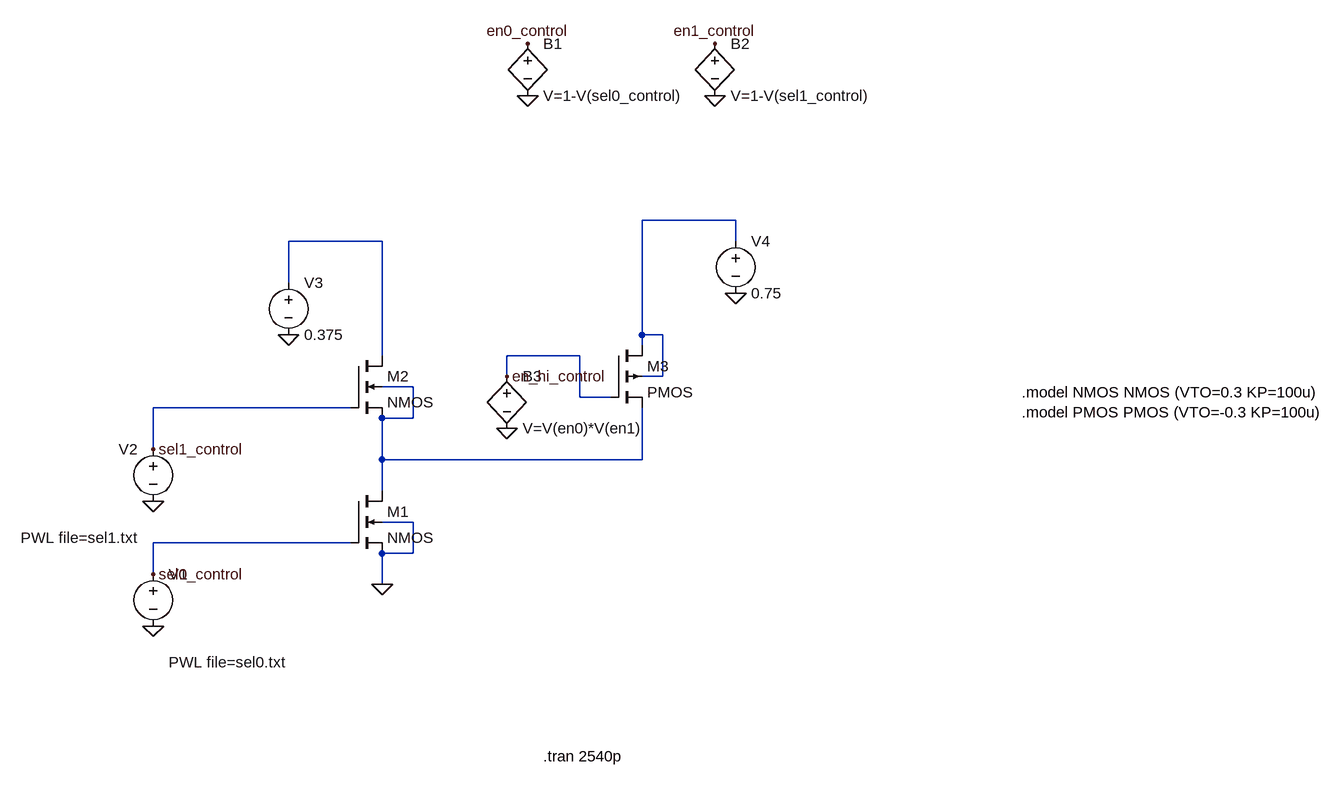
[diagram p0: schematic pulluppulldown_pam3_driver.asc]
pulluppulldown_pam3_driver.asc, the LTspice schematic file:
Version 4
SHEET 1 1388 776
WIRE 464 -64 320 -64
WIRE -80 -32 -224 -32
WIRE 464 -32 464 -64
WIRE -224 32 -224 -32
WIRE 320 112 320 -64
WIRE 352 112 320 112
WIRE 320 128 320 112
WIRE -80 144 -80 -32
WIRE 224 144 112 144
WIRE 112 176 112 144
WIRE 352 176 352 112
WIRE 352 176 320 176
WIRE -32 192 -80 192
WIRE 224 208 224 144
WIRE 272 208 224 208
WIRE -128 224 -432 224
WIRE -32 240 -32 192
WIRE -32 240 -80 240
WIRE -432 288 -432 224
WIRE -80 304 -80 240
WIRE 320 304 320 224
WIRE 320 304 -80 304
WIRE -80 352 -80 304
WIRE -32 400 -80 400
WIRE -128 432 -432 432
WIRE -32 448 -32 400
WIRE -32 448 -80 448
WIRE -432 480 -432 432
WIRE -80 496 -80 448
FLAG -432 480 sel0_control
FLAG -432 368 0
FLAG -432 560 0
FLAG -432 288 sel1_control
FLAG 144 -256 0
FLAG 144 -336 en0_control
FLAG 432 -256 0
FLAG 432 -336 en1_control
FLAG 112 176 en_hi_control
FLAG 112 256 0
FLAG -80 496 0
FLAG -224 112 0
FLAG 464 48 0
SYMBOL voltage -432 464 R0
WINDOW 3 24 152 Left 2
WINDOW 123 0 0 Left 0
WINDOW 39 24 124 Left 2
SYMATTR Value PWL file=sel0.txt
SYMATTR InstName V1
SYMBOL voltage -432 272 M0
WINDOW 3 24 152 Left 2
WINDOW 123 0 0 Left 0
WINDOW 39 24 124 Left 2
SYMATTR Value PWL file=sel1.txt
SYMATTR InstName V2
SYMBOL bv 144 -352 R0
SYMATTR InstName B1
SYMATTR Value V=1-V(sel0_control)
SYMBOL bv 432 -352 R0
SYMATTR InstName B2
SYMATTR Value V=1-V(sel1_control)
SYMBOL bv 112 160 R0
SYMATTR InstName B3
SYMATTR Value V=V(en0)*V(en1)
SYMBOL nmos4 -128 352 R0
SYMATTR InstName M1
SYMATTR Value2 l=45n w=1.0u
SYMBOL nmos4 -128 144 R0
SYMATTR InstName M2
SYMATTR Value2 l=45n w=1.0u
SYMBOL voltage -224 16 R0
WINDOW 123 0 0 Left 0
WINDOW 39 0 0 Left 0
SYMATTR InstName V3
SYMATTR Value 0.375
SYMBOL pmos4 272 128 R0
SYMATTR InstName M3
SYMATTR Value2 l=45n w=1.0u
SYMBOL voltage 464 -48 R0
WINDOW 123 0 0 Left 0
WINDOW 39 0 0 Left 0
SYMATTR InstName V4
SYMATTR Value 0.75
TEXT 168 760 Left 2 !.tran 2540p
TEXT 904 200 Left 2 !.model NMOS NMOS (VTO=0.3 KP=100u)\n.model PMOS PMOS (VTO=-0.3 KP=100u)

The netlist it stands for:
* pulluppulldown_pam3_driver.asc
V1 sel0_control 0 PWL file=sel0.txt
V2 sel1_control 0 PWL file=sel1.txt
B1 en0_control 0 V=1-V(sel0_control)
B2 en1_control 0 V=1-V(sel1_control)
B3 en_hi_control 0 V=V(en0)*V(en1)
M1 N003 sel0_control 0 0 NMOS l=45n w=1.0u
M2 N002 sel1_control N003 N003 NMOS l=45n w=1.0u
V3 N002 0 0.375
M3 N001 en_hi_control N003 N001 PMOS l=45n w=1.0u
V4 N001 0 0.75
.model NMOS NMOS
.model PMOS PMOS
.lib standard.mos
.tran 2540p
.model NMOS NMOS (VTO=0.3 KP=100u)
.model PMOS PMOS (VTO=-0.3 KP=100u)
.backanno
.end